# EAGLE design SPLED-01 (EAGLE 6.2)
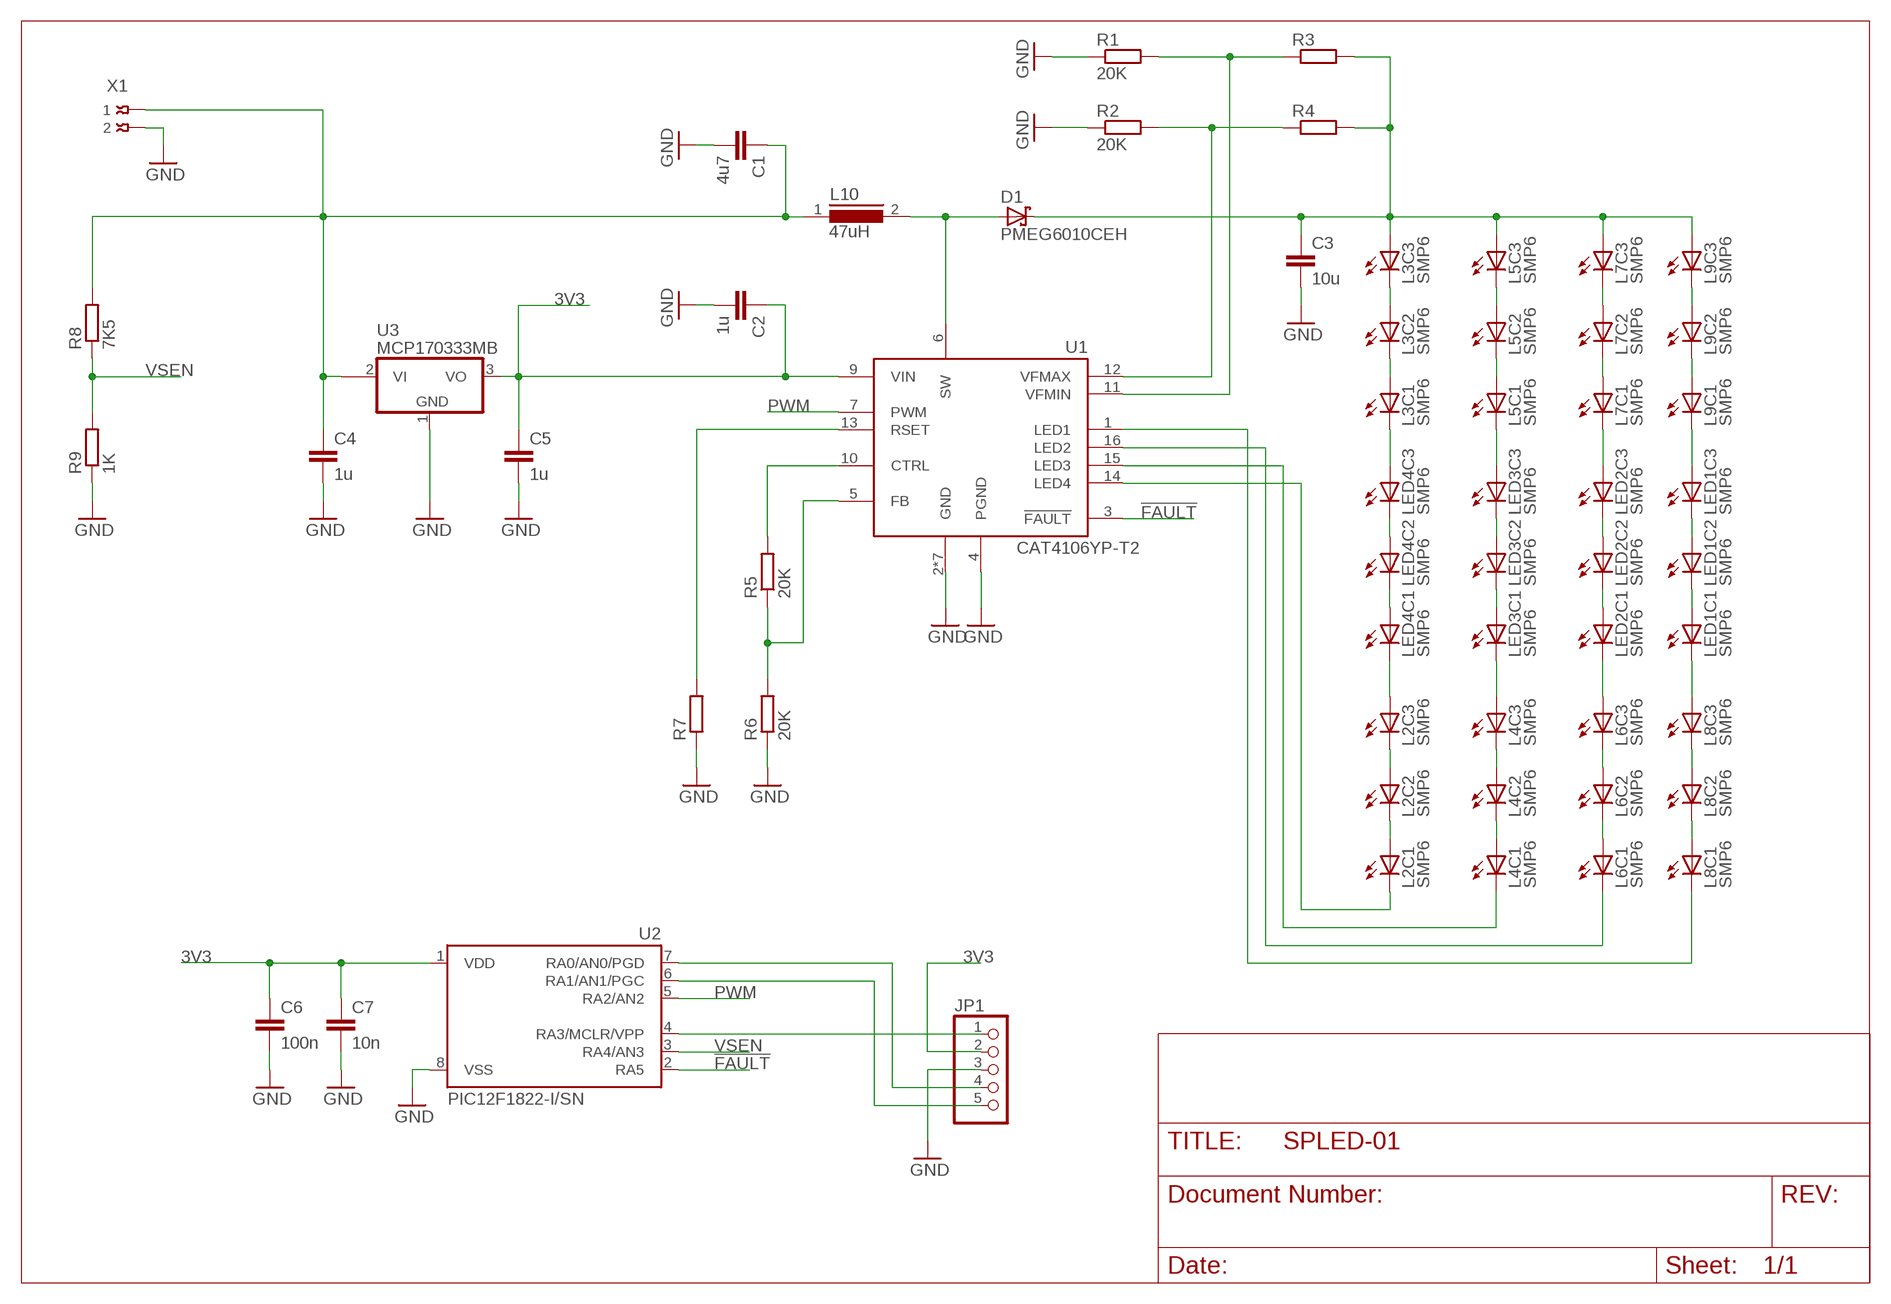
[diagram p0: schematic, sheet 1]

## Parts
C1  4u7  C-EUC1206K  [C1206K]
C2  1u  C-EUC1206K  [C1206K]
C3  10u  C-EUC1206K  [C1206K]
C4  1u  C-EUC1206K  [C1206K]
C5  1u  C-EUC1206K  [C1206K]
C6  100n  C-EUC1206K  [C1206K]
C7  10n  C-EUC1206K  [C1206K]
D1  PMEG6010CEH  SMF5.0AT1  [SOD123FL]
JP1  PINHD-1X5-2MM  [1X05-2MM]
L2  SMP6  [PLCC6]
L3  SMP6  [PLCC6]
L4  SMP6  [PLCC6]
L5  SMP6  [PLCC6]
L6  SMP6  [PLCC6]
L7  SMP6  [PLCC6]
L8  SMP6  [PLCC6]
L9  SMP6  [PLCC6]
L10  47uH  DR73  [DR73]
LED1  SMP6  [PLCC6]
LED2  SMP6  [PLCC6]
LED3  SMP6  [PLCC6]
LED4  SMP6  [PLCC6]
R1  20K  R-EU_R1206  [R1206]
R2  20K  R-EU_R1206  [R1206]
R3  R-EU_R1206  [R1206]
R4  R-EU_R1206  [R1206]
R5  20K  R-EU_R1206  [R1206]
R6  20K  R-EU_R1206  [R1206]
R7  R-EU_R1206  [R1206]
R8  7K5  R-EU_R1206  [R1206]
R9  1K  R-EU_R1206  [R1206]
U1  CAT4106YP-T2  [TSSOP16]
U2  PIC12F1822-I/SN  [SO08]
U3  MCP170333MB  [SOT89]
X1  009176002  [009176002]

## Nets
3V3 [3V3Power]: C2.1 C5.1 C6.1 C7.1 JP1.2 U1.9(VIN) U2.1(VDD) U3.3(VO)
!FAULT!: U1.3(!FAULT!) U2.2(RA5)
GND: C1.2 C2.2 C3.2 C4.2 C5.2 C6.2 C7.2 JP1.3 R1.1 R2.1 R6.1 R7.1 R9.1 U1.2(GND) U1.4(PGND) U1.P$1(GND) U1.P$2(GND) U1.P$3(GND) U1.P$4(GND) U1.P$5(GND) U1.P$6(GND) U2.8(VSS) U3.1(GND) X1.2
N$2 [LedPower]: D1.A L10.2 U1.6(SW)
N$3 [LedPower]: L3.4(C2:A) L3.5(C3:C)
N$4 [LedPower]: L3.2(C1:A) L3.3(C2:C)
N$5 [LedPower]: L3.1(C1:C) LED4.6(C3:A)
N$6 [LedPower]: L2.4(C2:A) L2.5(C3:C)
N$7 [LedPower]: L2.2(C1:A) L2.3(C2:C)
N$8 [LedPower]: L5.4(C2:A) L5.5(C3:C)
N$9 [LedPower]: L5.2(C1:A) L5.3(C2:C)
N$10 [LedPower]: L5.1(C1:C) LED3.6(C3:A)
N$11 [LedPower]: L4.4(C2:A) L4.5(C3:C)
N$12 [LedPower]: L4.2(C1:A) L4.3(C2:C)
N$13 [LedPower]: L6.2(C1:A) L6.3(C2:C)
N$14 [LedPower]: L6.4(C2:A) L6.5(C3:C)
N$15 [LedPower]: L7.1(C1:C) LED2.6(C3:A)
N$16 [LedPower]: L7.2(C1:A) L7.3(C2:C)
N$17 [LedPower]: L7.4(C2:A) L7.5(C3:C)
N$18 [LedPower]: L9.4(C2:A) L9.5(C3:C)
N$19 [LedPower]: L9.2(C1:A) L9.3(C2:C)
N$20 [LedPower]: L9.1(C1:C) LED1.6(C3:A)
N$21 [LedPower]: L8.4(C2:A) L8.5(C3:C)
N$22 [LedPower]: L8.2(C1:A) L8.3(C2:C)
N$23 [LedPower]: C3.1 D1.C L3.6(C3:A) L5.6(C3:A) L7.6(C3:A) L9.6(C3:A) R3.2 R4.2
N$24 [LedPower]: L2.1(C1:C) U1.14(LED4)
N$25 [LedPower]: L4.1(C1:C) U1.15(LED3)
N$26 [LedPower]: L6.1(C1:C) U1.16(LED2)
N$27 [LedPower]: L8.1(C1:C) U1.1(LED1)
N$28 [LedPower]: LED1.4(C2:A) LED1.5(C3:C)
N$29 [LedPower]: LED1.2(C1:A) LED1.3(C2:C)
N$30: R5.2 U1.10(CTRL)
N$31: R2.2 R4.1 U1.12(VFMAX)
N$32: R1.2 R3.1 U1.11(VFMIN)
N$33 [LedPower]: L8.6(C3:A) LED1.1(C1:C)
N$34 [LedPower]: L6.6(C3:A) LED2.1(C1:C)
N$35: R5.1 R6.2 U1.5(FB)
N$36 [LedPower]: LED2.2(C1:A) LED2.3(C2:C)
N$37: R7.2 U1.13(RSET)
N$38 [LedPower]: LED2.4(C2:A) LED2.5(C3:C)
N$39 [LedPower]: LED3.4(C2:A) LED3.5(C3:C)
N$40 [LedPower]: LED3.2(C1:A) LED3.3(C2:C)
N$41 [LedPower]: L4.6(C3:A) LED3.1(C1:C)
N$42 [LedPower]: L2.6(C3:A) LED4.1(C1:C)
N$43 [LedPower]: LED4.2(C1:A) LED4.3(C2:C)
N$44 [LedPower]: LED4.4(C2:A) LED4.5(C3:C)
PGC: JP1.5 U2.6(RA1/AN1/PGC)
PGD: JP1.4 U2.7(RA0/AN0/PGD)
PWM: U1.7(PWM) U2.5(RA2/AN2)
VBAT [LedPower]: C1.1 C4.1 L10.1 R8.2 U3.2@1(VI1) X1.1
VPP: JP1.1 U2.4(RA3/MCLR/VPP)
VSEN: R8.1 R9.2 U2.3(RA4/AN3)
Unconnected: U3.2(VI)

## Library data of the parts
C1-C7 = rcl:C-EU: CAPACITOR, European symbol
D1 = diode:SMF5.0AT1: 200 W Transient Voltage Suppressor Source: Data sheet <http://www.onsemi.com/pub_link/Collateral/SMF5.0AT1-D.PDF>
JP1 = pinhead200:PINHD-1X5-2MM: PIN HEADER
L2-L9 LED1-LED4 = bivar-led:SMP6: BIVAC triple whire led
L10 = inductors:DR73: High Power Density, High Efficiency, Shielded Inductors Source: coiltronics_dr_series.pdf
R1-R9 = rcl:R-EU_: RESISTOR, European symbol
U1 = onsemiconductor:CAT4106: 6W Quad Channel DC/DC LED Driver
U2 = microchip-pic:PIC12F1822: Microcontrolador PIC12F1822
U3 = linear:MCP1703*: 250 mA, 16V, Low Quiescent Current LDO Regulator Source: http://ww1.microchip.com/downloads/en/DeviceDoc/22049b.pdf
X1 = con-avx:00917?002: Wire to Board Strip IDC Connector 2 WAY Source: http://www.avx.com/docs/Catalogs/9176.pdf http://www.avx.com/docs/Catalogs/9177.pdf; MPN: 009176002001006; OC_FARNELL: 1582834; OC_NEWARK: 66M1960

## Net classes
1 LedPower: width 0.4 mm
2 3V3Power: width 0.2 mm

## Board
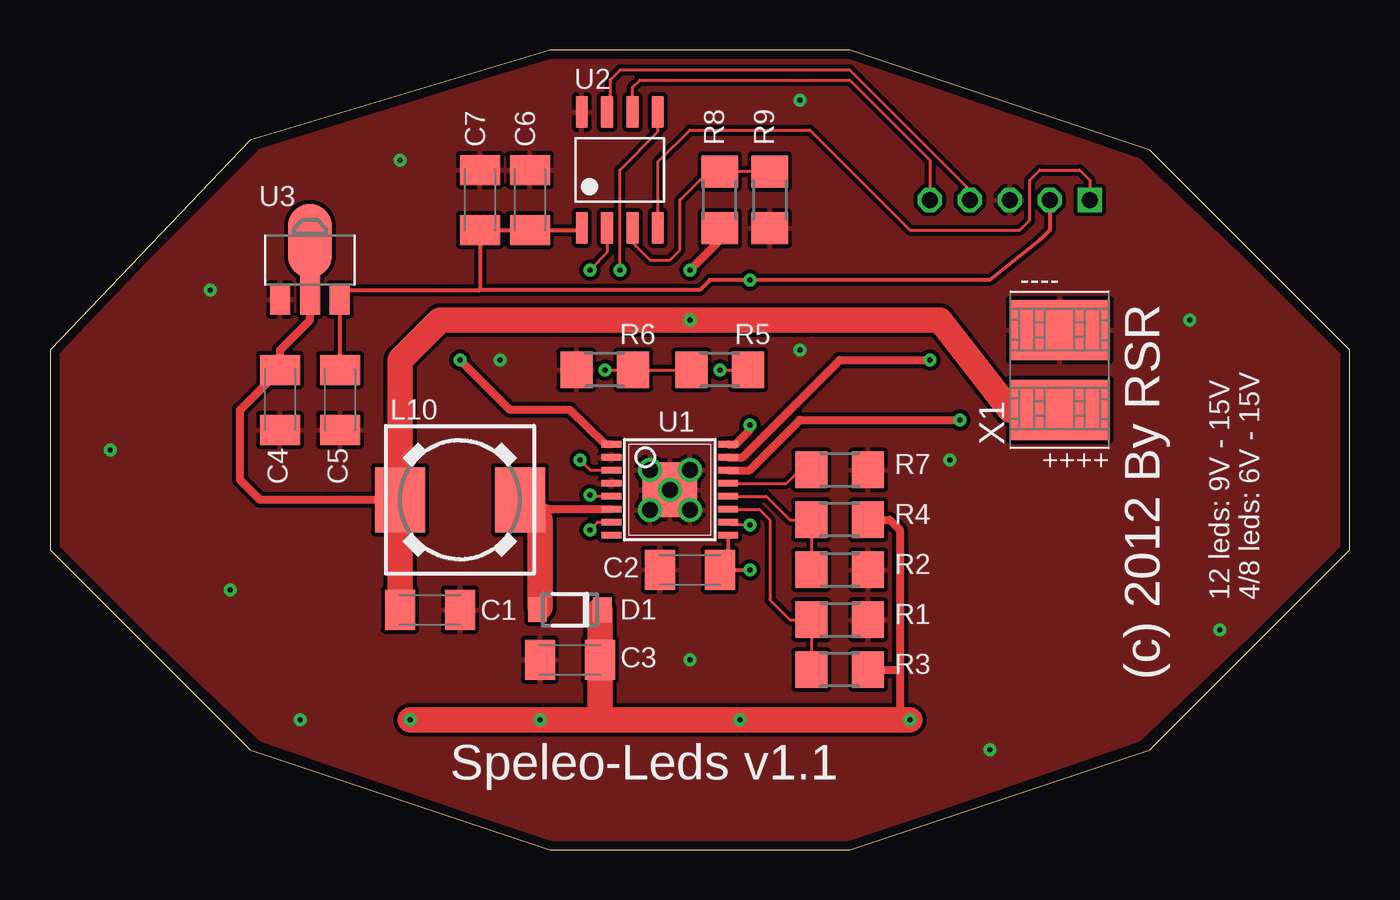
[diagram p1: board, top side]
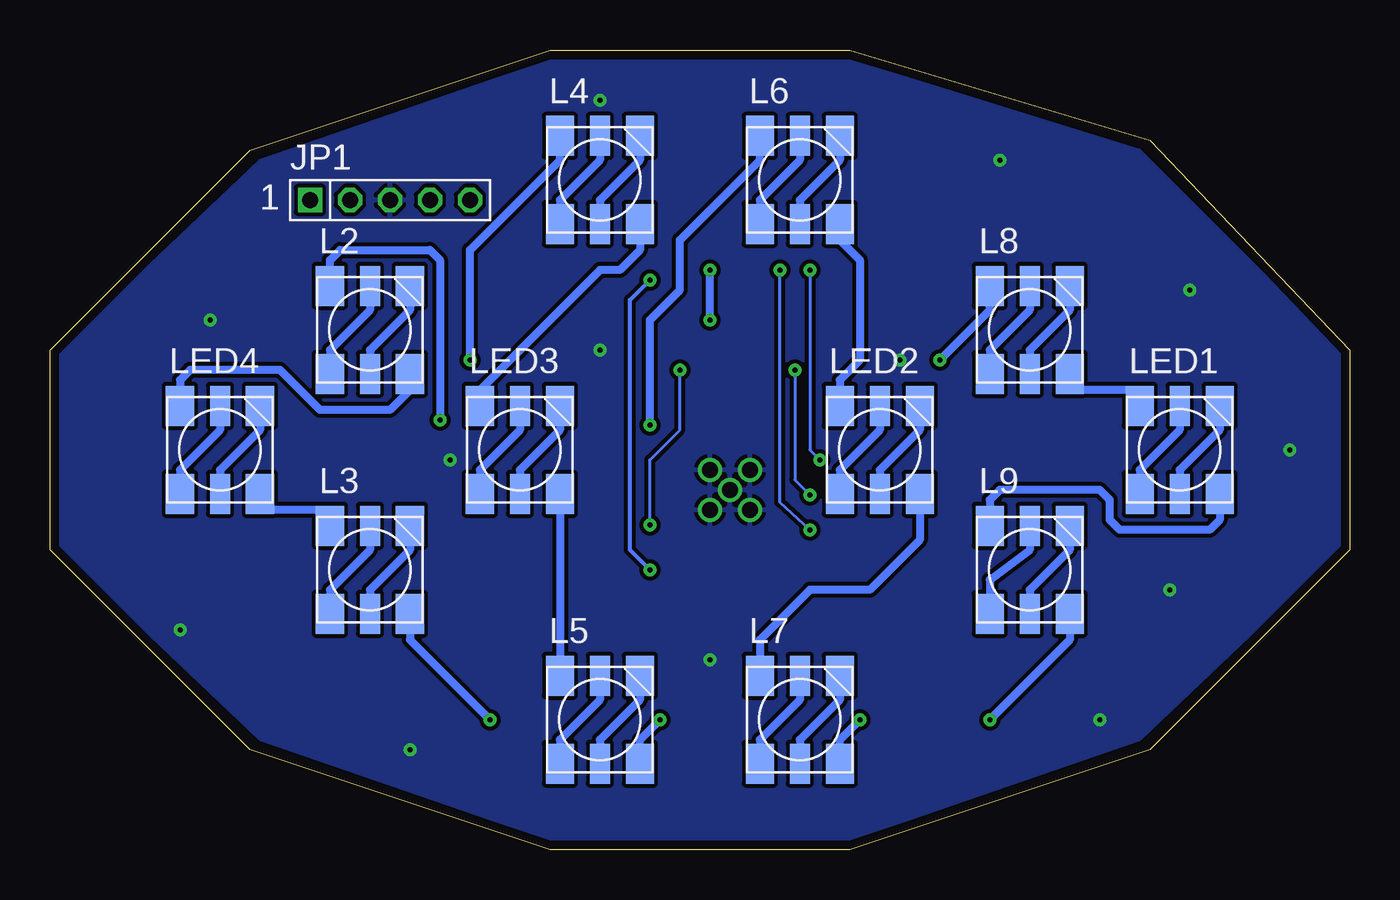
[diagram p2: board, bottom side, seen from below]

Size 65 x 40 mm. Coordinates in mm from the lower left corner, seen from the top.
Outline: 0,15 10,5 25,0 40,0 55,5 65,15 65,25 55,35 40,40 25,40 10,35.5 0,25 0,15
Copper layers (1*16): Top 0.035mm / dielectric 1.55mm / Bottom 0.035mm
Design rules: minimum track width 0.15mm, minimum drill 0.25mm, track to track 0.2mm, track to pad 0.2mm, pad to pad 0.2mm, via to via 0.2mm, smd to smd 0.2mm, copper to edge 0.45mm, drill to drill 0.3mm, minimum pad ring 0.2mm, minimum via ring 0.2mm, stop-mask expansion 0.1mm, vias tented up to drill 0mil, thermal gap 0.2mm

### Footprints (pad centres in the part's own frame; a part is rotated, then mirrored left to right if it is on the bottom)
C1206K = smd 1.5 x 2: 1 -1.5,0; 2 1.5,0
SOD123FL = smd 0.91 x 1.22: A 1.625,0; C -1.625,0
1X05-2MM = drill 0.8 square: 1 -4,0 | drill 0.8 octagon: 2 -2,0; 3 0,0; 4 2,0; 5 4,0
PLCC6 = smd 1.4 x 2: 1 -2,2.2; 2 -2,-2.2; 5 2,2.2; 6 2,-2.2 | smd 1 x 2: 3 0,2.2; 4 0,-2.2
DR73 = smd 2.5 x 3.25: 1 -3,0; 2 3,0
R1206 = smd 1.6 x 1.803: 1 -1.422,0; 2 1.422,0
TSSOP16 = smd 0.305 x 0.991: 1 -2.275,-2.918; 2 -1.625,-2.918; 3 -0.975,-2.918; 4 -0.325,-2.918; 5 0.325,-2.918; 6 0.975,-2.918; 7 1.625,-2.918; 8 2.275,-2.918; 9 2.275,2.918; 10 1.625,2.918; 11 0.975,2.918; 12 0.325,2.918; 13 -0.325,2.918; 14 -0.975,2.918; 15 -1.625,2.918; 16 -2.275,2.918 | smd 2.74 x 2.74: P$1 0,0 | drill 0.8: P$2 -1,1; P$3 1,1; P$4 1,-1; P$5 -1,-1; P$6 0,0
SO08 = smd 0.6 x 1.6: 1 -1.905,-2.9; 2 -0.635,-2.9; 3 0.635,-2.9; 4 1.905,-2.9; 5 1.905,2.9; 6 0.635,2.9; 7 -0.635,2.9; 8 -1.905,2.9
SOT89 = smd 1 x 1.5: 1 -1.499,-1.981; 3 1.499,-1.981 | smd 1 x 2: 2 0,-1.727 | smd 2.2 x 3.7: 2@1 0,0.94
009176002 = smd 3 x 5: 1 -2,0; 2 2,0

### Placement (x,y rotation side)
C1  19,12 0 top
C2  32,14 180 top
C3  26,9.5 180 top
C4  11.5,22.5 270 top
C5  14.5,22.5 270 top
C6  24,32.5 90 top
C7  21.5,32.5 90 top
D1  26,12 180 top
JP1  48,32.5 0 bottom
L2  49,26 0 bottom
L3  49,14 0 bottom
L4  37.5,33.5 0 bottom
L5  37.5,6.5 0 bottom
L6  27.5,33.5 0 bottom
L7  27.5,6.5 0 bottom
L8  16,26 0 bottom
L9  16,14 0 bottom
L10  20.5,17.5 0 top
LED1  8.5,20 0 bottom
LED2  23.5,20 0 bottom
LED3  41.5,20 0 bottom
LED4  56.5,20 0 bottom
R1  39.5,11.5 180 top
R2  39.5,14 180 top
R3  39.5,9 0 top
R4  39.5,16.5 0 top
R5  33.5,24 0 top
R6  27.75,24 0 top
R7  39.5,19 180 top
R8  33.5,32.5 270 top
R9  36,32.5 90 top
U1  31,18 270 top
U2  28.5,34 0 top
U3  13,29.5 0 top
X1  50.5,24 90 top

### Tracks (layer width: path | path; a pad name or v marks a point on that pad's centre or on a via)
3V3  (via drill 0.25)
  Top 0.15: U3.3 14.5,27.5 14.5,28 | 26.5,31 U2.1
  Top 0.2: C5.1 14.5,27.5 | 14.5,28 21.5,28 | 26.5,31 C6.1 C7.1 21.5,28 | JP1.2 50,31 49.5,30.5 47,28.5 v35,28.5 33,28.5 32.5,28 21.5,28 | U1.9 33.92,14.58 C2.1 v35,14
  Bottom 0.2: v35,14 36,15 36,27.5 v35,28.5
!FAULT!  (via drill 0.25)
  Top 0.15: U2.2 27.86,29.86 v27,29 | U1.3 28,19 27,19 v26.5,19.5
  Bottom 0.15: v27,29 27,20 v26.5,19.5
GND  (via drill 0.25)
  other vias: 37.5,37.5 57,26.5 45,19.5 37.5,25 22.5,24.5 58.5,11 47,5 12.5,6.5 9,13 3,20 8,28 17.5,34.5 32,9.5
  pour Top: 0.5,25 0.5,15 10.5,5.5 25,0.5 40,0.5 54.5,5.5 64.5,15 64.5,25 54.5,34.5 40,39.5 25,39.5 10.5,35
  pour Bottom: 0.5,25 0.5,15 10.5,5.5 25,0.5 40,0.5 54.5,5.5 64.5,15 64.5,25 54.5,34.5 40,39.5 25,39.5 10.5,35
N$2
  Top 0.4: U1.6 24.98,17.02 | 24.98,17.02 L10.2 | 24.98,17.02 24.98,16.98 24.5,16.5 | 24.5,12.12 D1.A
  Top 1.27: 24.5,16.5 24.5,12.12
N$3
  Bottom 0.4: L3.5 47,15 49,13 L3.4
N$4
  Bottom 0.4: L3.3 49,15 51,13 L3.2
N$5
  Bottom 0.4: L3.1 51,17 54.5,17 54.4,17.2 LED4.6
N$6
  Bottom 0.4: L2.5 47,27 49,25 L2.4
N$7
  Bottom 0.4: L2.3 49,27 51,25 L2.2
N$8
  Bottom 0.4: L5.5 35.5,7.5 37.5,5.5 L5.4
N$9
  Bottom 0.4: L5.3 37.5,7.5 39.5,5.5 L5.2
N$10
  Bottom 0.4: LED3.6 L5.1
N$11
  Bottom 0.4: L4.5 35.5,34.5 37.5,32.5 L4.4
N$12
  Bottom 0.4: L4.3 37.5,34.5 39.5,32.5 L4.2
N$13
  Bottom 0.4: L6.3 27.5,34.5 29.5,32.5 L6.2
N$14
  Bottom 0.4: L6.5 25.5,34.5 27.5,32.5 L6.4
N$15
  Bottom 0.4: LED2.6 21.5,15.5 24,13 27,13 29.5,10.5 L7.1
N$16
  Bottom 0.4: L7.3 27.5,7.5 29.5,5.5 L7.2
N$17
  Bottom 0.4: L7.5 25.5,7.5 27.5,5.5 L7.4
N$18
  Bottom 0.4: L9.5 14,15 16,13 L9.4
N$19
  Bottom 0.4: L9.3 16,15 18,13.5 L9.2
N$20
  Bottom 0.4: LED1.6 6.5,16.5 7,16 11.5,16 12,16.5 12,17.5 12.5,18 17.5,18 18,17.5 L9.1
N$21
  Bottom 0.4: L8.5 14,27 16,25 L8.4
N$22
  Bottom 0.4: L8.3 16,27 18,25 L8.2
N$23  (via drill 0.25)
  Top 0.4: C3.1 27.62,9.62 27.62,9.88 27.5,10 | D1.C 27.5,12 | R4.2 42,16.5 42.5,16 42.5,9 | 42.5,9 42.5,7 v43,6.5 | R3.2 42.5,9
  Top 1.27: 27.5,10 27.5,12 | v18,6.5 v24.5,6.5 27.5,6.5 | 27.5,6.5 v34.5,6.5 v43,6.5 | C3.1 27.5,6.5
  Bottom 0.4: L7.6 25.5,5.5 v24.5,6.5 | L5.6 35.5,5.5 v34.5,6.5 | L3.6 47,10.5 v43,6.5 | L9.6 14,10.5 v18,6.5
  Bottom 1.016: 14,12 L9.6
N$24  (via drill 0.25)
  Top 0.4: U1.14 34.98,18.98 37.5,21.5 v45.5,21.5
  Bottom 0.4: 50.5,28 L2.1 51,29.5 50.5,30 46,30 45.5,29.5 v45.5,21.5
N$25  (via drill 0.25)
  Top 0.4: U1.15 34.62,19.62 39.5,24.5 v44,24.5
  Bottom 0.4: v44,24.5 44,30 39.5,34.5 L4.1
N$26  (via drill 0.25)
  Top 0.4: U1.16 34.27,20.27 35,21 v35,21.25
  Bottom 0.4: v35,21.25 35,26.5 33.5,28 33.5,30.5 29.5,34.5 L6.1
N$27  (via drill 0.25)
  Top 0.4: U1.1 27.77,20.27 26,22 23,22 v20.5,24.5
  Bottom 0.4: v20.5,24.5 18,27 L8.1
N$28
  Bottom 0.4: LED1.5 6.5,21 8.5,19 LED1.4
N$29
  Bottom 0.4: LED1.3 8.5,21 10.5,19 LED1.2
N$30  (via drill 0.25)
  Top 0.15: v33.5,24 R5.2 | v35,16.25 34.04,16.25 U1.10
  Bottom 0.15: v35,16.25 35,19.5 33.5,21 v33.5,24
N$31
  Top 0.15: U1.12 35.83,17.68 37,16.5 R4.1 R2.2
N$32
  Top 0.15: U1.11 35.48,17.02 36,16.5 36,12.5 37,11.5 R1.2 R3.1
N$33
  Bottom 0.4: LED1.1 10.7,22.7 11,23 13.7,23 L8.6
N$34
  Bottom 0.4: L6.6 25.5,30.5 24.5,29.5 24.5,24.5 25.5,23.5 LED2.1
N$35  (via drill 0.25)
  Top 0.15: 28,17.62 28.12,17.75 U1.5 27.2,17.68 27.12,17.75 v27,17.75 | R5.1 R6.2 v27.75,24
  Bottom 0.15: v27.75,24 27.75,18.5 v27,17.75
N$36
  Bottom 0.4: LED2.3 23.5,21 25.5,19 LED2.2
N$37
  Top 0.15: U1.13 36.83,18.32 37.5,19 R7.2
N$38
  Bottom 0.4: LED2.5 21.5,21 23.5,19 LED2.4
N$39
  Bottom 0.4: LED3.5 39.5,21 41.5,19 LED3.4
N$40
  Bottom 0.4: LED3.3 41.5,21 43.5,19 LED3.2
N$41
  Bottom 0.4: LED3.1 43.5,22 | 43,23 43,22.7 LED3.1 | L4.6 35.5,30 36.5,29 37.5,29 43.5,23 43.5,22.5 43.38,22.5 LED3.1
N$42
  Bottom 0.4: L2.6 47,23 48,22 51.5,22 53.5,24 58,24 58.5,23.5 LED4.1
N$43
  Bottom 0.4: LED4.3 56.5,21 58.5,19 LED4.2
N$44
  Bottom 0.4: LED4.5 54.5,21 56.5,19 LED4.4
PGC
  Top 0.15: U2.6 29.14,38.13 29.5,38.5 40,38.5 44,34.5 JP1.5
PGD
  Top 0.15: JP1.4 46,33 40,39 28.5,39 28,38.5 28,37.03 U2.7
PWM  (via drill 0.25)
  Top 0.15: U1.7 27.38,16.38 v27,16 | v28.5,29 28.5,34 30.41,35.91 30.41,36.88 | 30.41,36.88 U2.5 | U2.5 30.5,37 | U2.5 30.38,36.88 30.41,36.88
  Bottom 0.15: v27,16 28.5,17.38 v28.5,29
VBAT  (via drill 0.25)
  Top 0.4: v32,29 33.5,30.5 R8.2 | U3.2@1 13,26.5 11.5,25 C4.1 9.5,22 9.5,18.5 10.5,17.5 L10.1
  Top 1.27: C1.1 L10.1 17.5,24.5 19.5,26.5 v32,26.5 44.5,26.5 48,22 X1.1
  Bottom 0.4: v32,26.5 v32,29
VPP
  Top 0.15: U2.4 30.41,34.41 32,36 38,36 43,31 48.5,31 49,31.5 49,33.5 49.5,34 51.5,34 52,33.5 JP1.1
VSEN
  Top 0.15: R9.2 33.08,33.92 33,34.5 33,34 | 33,34 R8.1 | U2.3 29.14,30.36 30,29.5 31,29.5 31.5,30 31.5,32.5 33,34

### Text on the board
tPlace: ---- | ++++ | 12 leds: 9V - 15V | 4/8 leds: 6V - 15V | (c) 2012 By RSR | Speleo-Leds v1.1